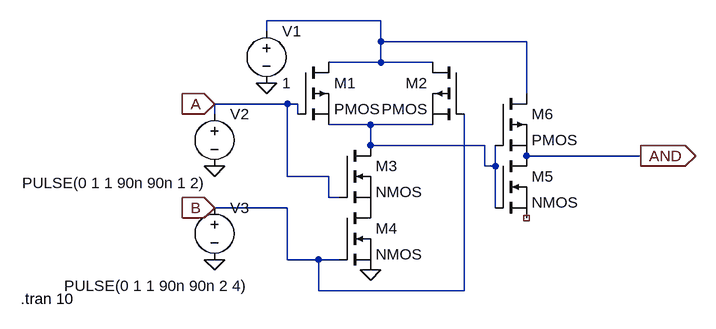
[diagram p0: schematic Draft6.asc]
Draft6.asc, the LTspice schematic file:
Version 4
SHEET 1 880 680
WIRE 192 -16 16 -16
WIRE 16 0 16 -16
WIRE 192 16 192 -16
WIRE 416 16 192 16
WIRE 192 48 192 16
WIRE 192 48 112 48
WIRE 272 48 192 48
WIRE 416 96 416 16
WIRE 48 112 -64 112
WIRE 64 112 48 112
WIRE -64 128 -64 112
WIRE 64 128 64 112
WIRE 176 144 112 144
WIRE 272 144 176 144
WIRE 176 176 176 144
WIRE 352 176 176 176
WIRE 592 192 416 192
WIRE 352 208 352 176
WIRE 368 208 368 176
WIRE 368 208 352 208
WIRE 48 224 48 112
WIRE 112 224 48 224
WIRE 112 256 112 224
WIRE 128 256 112 256
WIRE 48 272 -64 272
WIRE 368 272 368 208
WIRE 48 352 48 272
WIRE 96 352 48 352
WIRE 128 352 96 352
WIRE 96 400 96 352
WIRE 320 400 320 128
WIRE 320 400 96 400
FLAG 16 80 0
FLAG 176 368 0
FLAG -64 352 0
FLAG -64 208 0
FLAG 592 192 AND
IOPIN 592 192 Out
FLAG -64 112 A
IOPIN -64 112 In
FLAG -64 272 B
IOPIN -64 272 In
SYMBOL pmos 64 48 R0
SYMATTR InstName M1
SYMBOL pmos 320 48 M0
SYMATTR InstName M2
SYMBOL nmos 128 176 R0
SYMATTR InstName M3
SYMBOL nmos 128 272 R0
SYMATTR InstName M4
SYMBOL voltage 16 -16 R0
WINDOW 123 0 0 Left 0
WINDOW 39 0 0 Left 0
SYMATTR InstName V1
SYMATTR Value 1
SYMBOL voltage -64 112 R0
WINDOW 3 -296 122 Left 2
WINDOW 123 0 0 Left 0
WINDOW 39 0 0 Left 0
SYMATTR InstName V2
SYMATTR Value PULSE(0 1 1 90n 90n 1 2)
SYMBOL voltage -64 256 R0
WINDOW 3 -231 136 Left 2
WINDOW 123 0 0 Left 0
WINDOW 39 0 0 Left 0
SYMATTR InstName V3
SYMATTR Value PULSE(0 1 1 90n 90n 2 4)
SYMBOL nmos 368 192 R0
SYMATTR InstName M5
SYMBOL pmos 368 96 R0
SYMATTR InstName M6
TEXT -362 412 Left 2 !.tran 10

The netlist it stands for:
* Draft6.asc
M1 N001 A N002 N002 PMOS
M2 N001 B N002 N002 PMOS
M3 N002 A P001 P001 NMOS
M4 P001 B 0 0 NMOS
V1 N001 0 1
V2 A 0 PULSE(0 1 1 90n 90n 1 2)
V3 B 0 PULSE(0 1 1 90n 90n 2 4)
M5 AND N002 NC_01 NC_01 NMOS
M6 N001 N002 AND AND PMOS
.model NMOS NMOS
.model PMOS PMOS
.lib standard.mos
.tran 10
.backanno
.end